# Altium schematic sheet [13] - CPU - UNUSED.SchDoc
size A2; DocumentNumber: 13; SheetNumber: 13; SheetTotal: 31
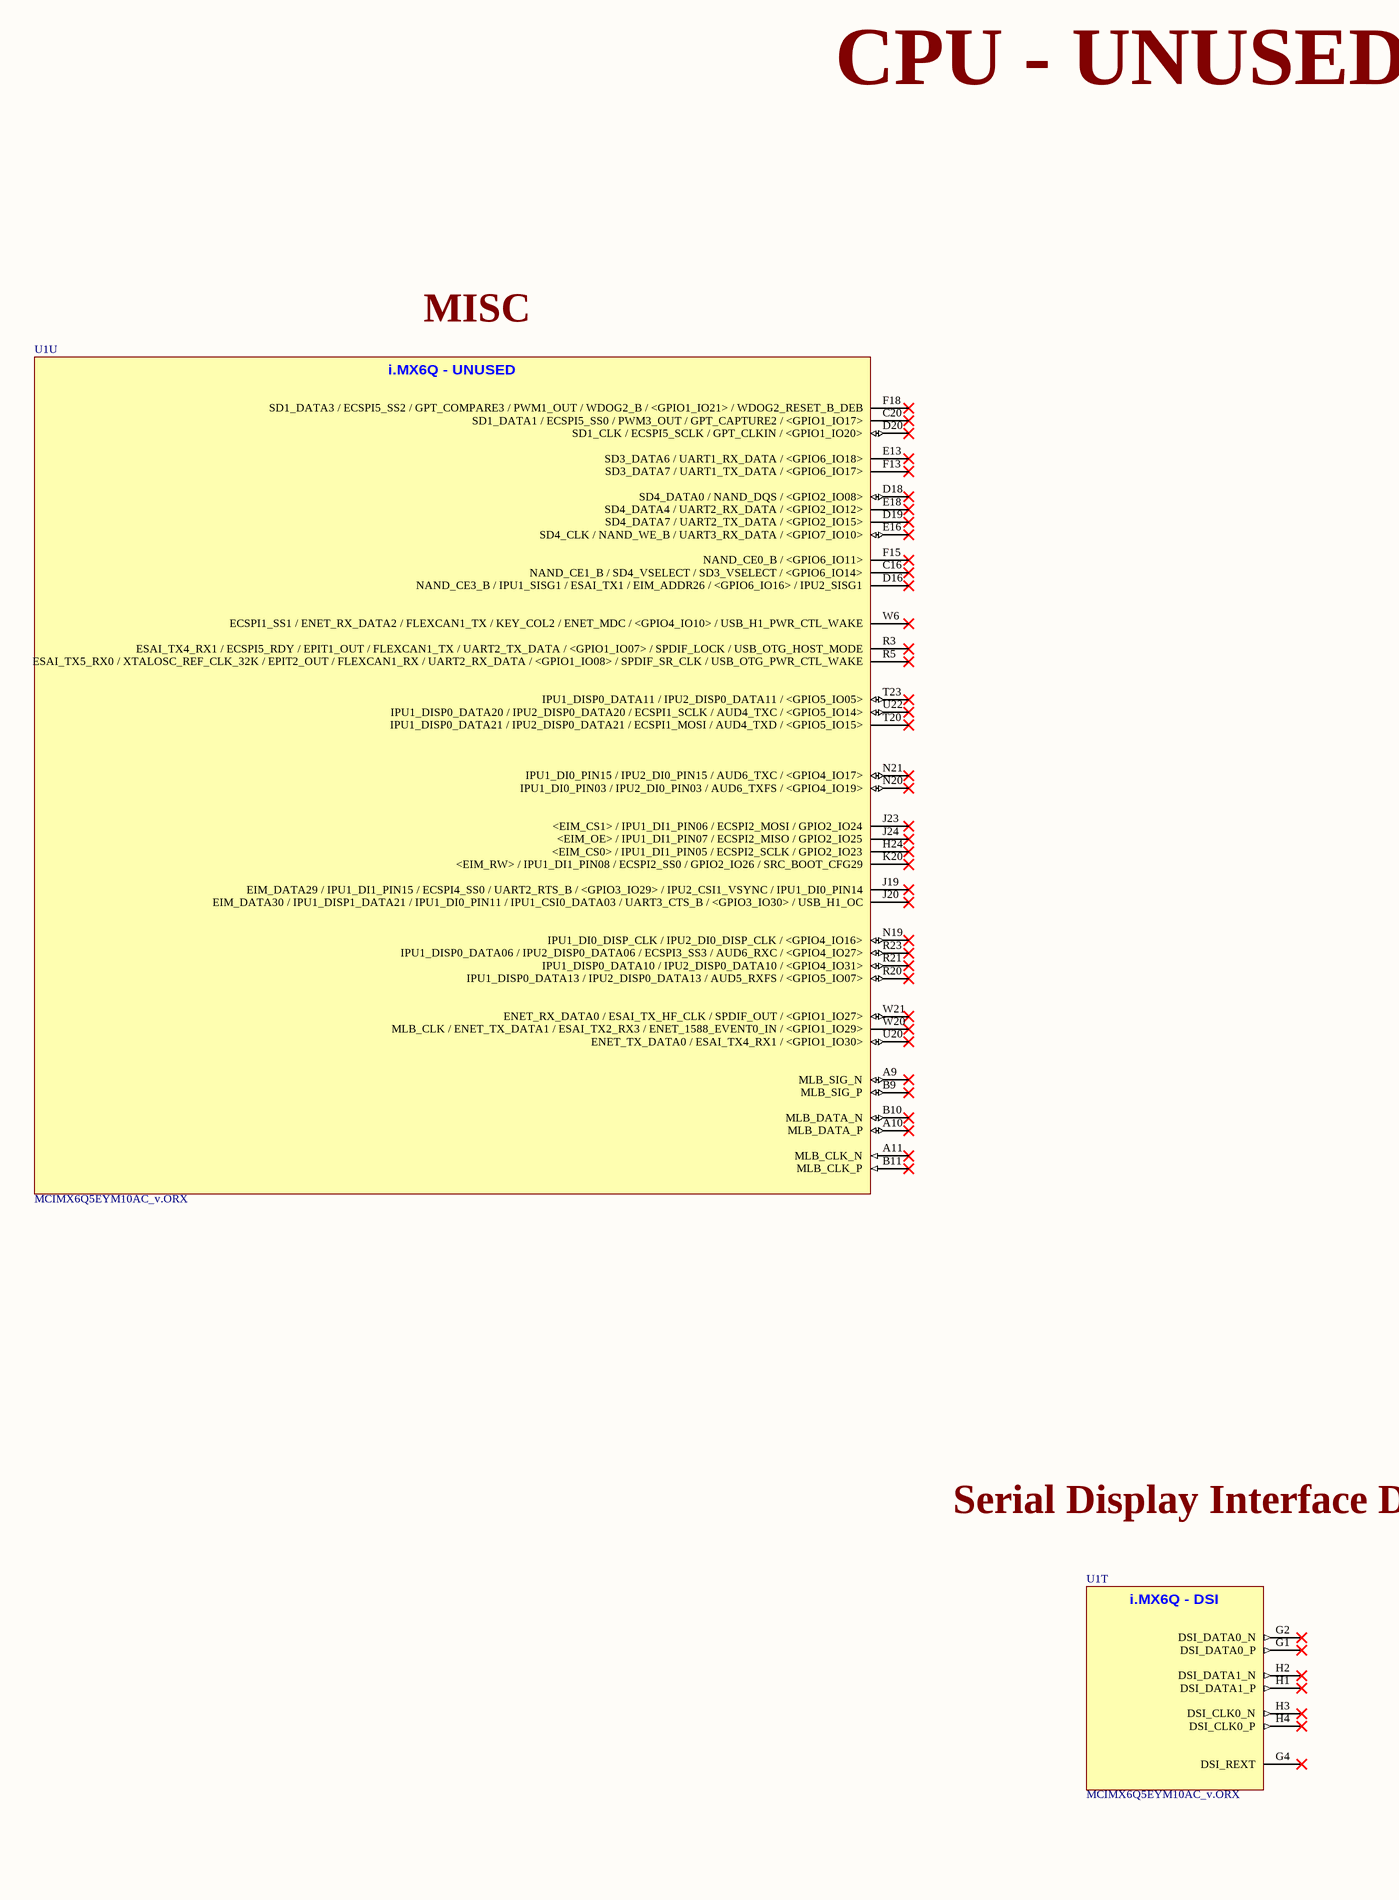
[diagram p0: [13] - CPU - UNUSED.SchDoc, left]
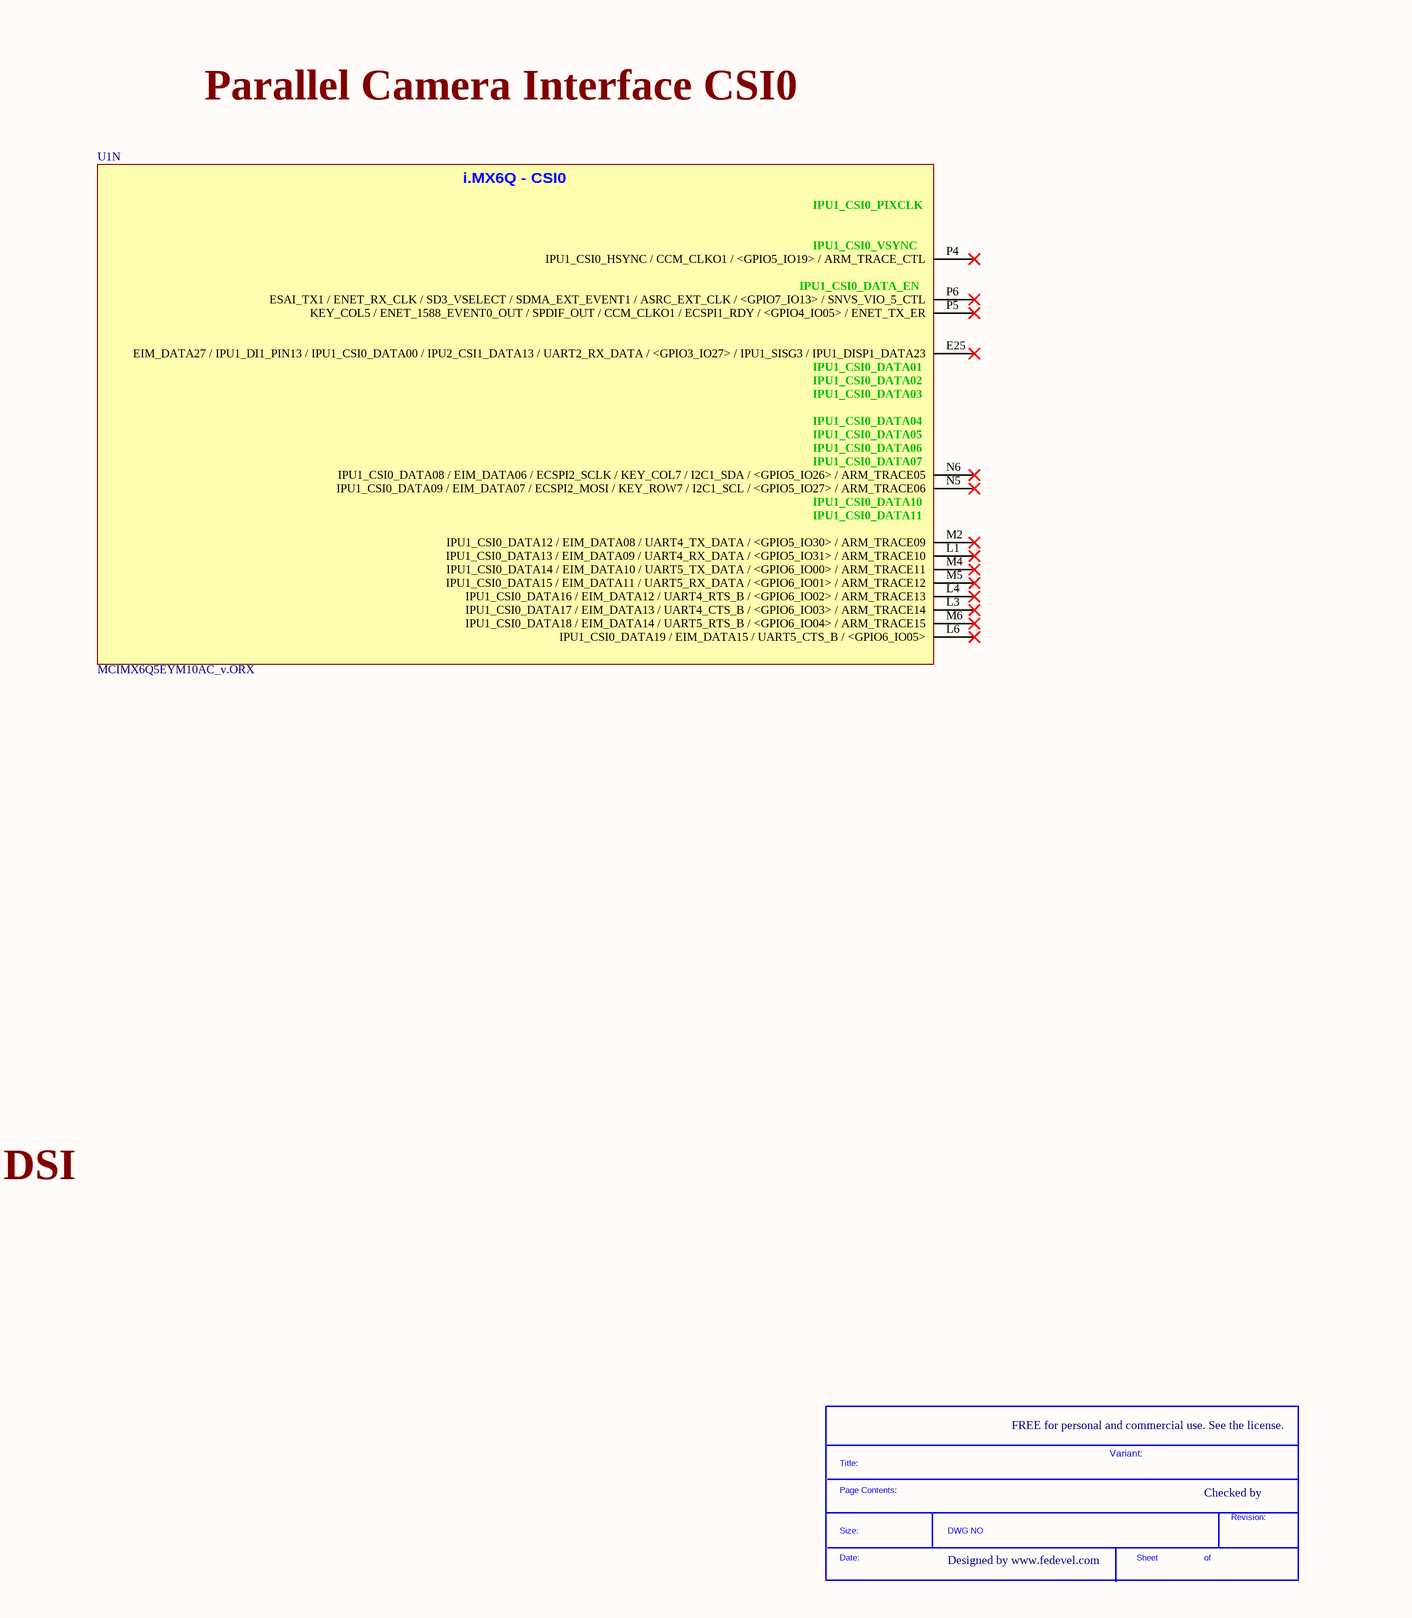
[diagram p1: [13] - CPU - UNUSED.SchDoc, right]

## Parts
*  SDTitleBlock  (value not drawn)  (graphical)
U1  MCIMX6Q5EYM10AC_v.ORX  [PBGA624]  (parts N,T,U of 21)

## Nets

Not connected (* = marked no-connect by the designer): U1 A9(MLB_SIG_N)* A10(MLB_DATA_P)* A11(MLB_CLK_N)* B9(MLB_SIG_P)* B10(MLB_DATA_N)* B11(MLB_CLK_P)* C16(NAND_CE1_B_/_SD4_VSELECT_/_SD3_VSELECT_/_<GPIO6_IO14>)* C20(SD1_DATA1_/_ECSPI5_SS0_/_PWM3_OUT_/_GPT_CAPTURE2_/_<GPIO1_IO17>)* D16(NAND_CE3_B_/_IPU1_SISG1_/_ESAI_TX1_/_EIM_ADDR26_/_<GPIO6_IO16>_/_IPU2_SISG1)* D18(SD4_DATA0_/_NAND_DQS_/_<GPIO2_IO08>)* D19(SD4_DATA7_/_UART2_TX_DATA_/_<GPIO2_IO15>)* D20(SD1_CLK_/_ECSPI5_SCLK_/_GPT_CLKIN_/_<GPIO1_IO20>)* E13(SD3_DATA6_/_UART1_RX_DATA_/_<GPIO6_IO18>)* E16(SD4_CLK_/_NAND_WE_B_/_UART3_RX_DATA_/_<GPIO7_IO10>)* E18(SD4_DATA4_/_UART2_RX_DATA_/_<GPIO2_IO12>)* E25(EIM_DATA27_/_IPU1_DI1_PIN13_/_IPU1_CSI0_DATA00_/_IPU2_CSI1_DATA13_/_UART2_RX_DATA_/_<GPIO3_IO27>_/_IPU1_SISG3_/_IPU1_DISP1_DATA23)* F13(SD3_DATA7_/_UART1_TX_DATA_/_<GPIO6_IO17>)* F15(NAND_CE0_B_/_<GPIO6_IO11>)* F18(SD1_DATA3_/_ECSPI5_SS2_/_GPT_COMPARE3_/_PWM1_OUT_/_WDOG2_B_/_<GPIO1_IO21>_/_WDOG2_RESET_B_DEB)* G1(DSI_DATA0_P)* G2(DSI_DATA0_N)* G4(DSI_REXT)* H1(DSI_DATA1_P)* H2(DSI_DATA1_N)* H3(DSI_CLK0_N)* H4(DSI_CLK0_P)* H24(<EIM_CS0>_/_IPU1_DI1_PIN05_/_ECSPI2_SCLK_/_GPIO2_IO23)* J19(EIM_DATA29_/_IPU1_DI1_PIN15_/_ECSPI4_SS0_/_UART2_RTS_B_/_<GPIO3_IO29>_/_IPU2_CSI1_VSYNC_/_IPU1_DI0_PIN14)* J20(EIM_DATA30_/_IPU1_DISP1_DATA21_/_IPU1_DI0_PIN11_/_IPU1_CSI0_DATA03_/_UART3_CTS_B_/_<GPIO3_IO30>_/_USB_H1_OC)* J23(<EIM_CS1>_/_IPU1_DI1_PIN06_/_ECSPI2_MOSI_/_GPIO2_IO24)* J24(<EIM_OE>_/_IPU1_DI1_PIN07_/_ECSPI2_MISO_/_GPIO2_IO25)* K20(<EIM_RW>_/_IPU1_DI1_PIN08_/_ECSPI2_SS0_/_GPIO2_IO26_/_SRC_BOOT_CFG29)* L1(IPU1_CSI0_DATA13_/_EIM_DATA09_/_UART4_RX_DATA_/_<GPIO5_IO31>_/_ARM_TRACE10)* L3(IPU1_CSI0_DATA17_/_EIM_DATA13_/_UART4_CTS_B_/_<GPIO6_IO03>_/_ARM_TRACE14)* L4(IPU1_CSI0_DATA16_/_EIM_DATA12_/_UART4_RTS_B_/_<GPIO6_IO02>_/_ARM_TRACE13)* L6(IPU1_CSI0_DATA19_/_EIM_DATA15_/_UART5_CTS_B_/_<GPIO6_IO05>)* M2(IPU1_CSI0_DATA12_/_EIM_DATA08_/_UART4_TX_DATA_/_<GPIO5_IO30>_/_ARM_TRACE09)* M4(IPU1_CSI0_DATA14_/_EIM_DATA10_/_UART5_TX_DATA_/_<GPIO6_IO00>_/_ARM_TRACE11)* M5(IPU1_CSI0_DATA15_/_EIM_DATA11_/_UART5_RX_DATA_/_<GPIO6_IO01>_/_ARM_TRACE12)* M6(IPU1_CSI0_DATA18_/_EIM_DATA14_/_UART5_RTS_B_/_<GPIO6_IO04>_/_ARM_TRACE15)* N5(IPU1_CSI0_DATA09_/_EIM_DATA07_/_ECSPI2_MOSI_/_KEY_ROW7_/_I2C1_SCL_/_<GPIO5_IO27>_/_ARM_TRACE06)* N6(IPU1_CSI0_DATA08_/_EIM_DATA06_/_ECSPI2_SCLK_/_KEY_COL7_/_I2C1_SDA_/_<GPIO5_IO26>_/_ARM_TRACE05)* N19(IPU1_DI0_DISP_CLK_/_IPU2_DI0_DISP_CLK_/_<GPIO4_IO16>)* N20(IPU1_DI0_PIN03_/_IPU2_DI0_PIN03_/_AUD6_TXFS_/_<GPIO4_IO19>)* N21(IPU1_DI0_PIN15_/_IPU2_DI0_PIN15_/_AUD6_TXC_/_<GPIO4_IO17>)* P4(IPU1_CSI0_HSYNC_/_CCM_CLKO1_/_<GPIO5_IO19>_/_ARM_TRACE_CTL)* P5(KEY_COL5_/_ENET_1588_EVENT0_OUT_/_SPDIF_OUT_/_CCM_CLKO1_/_ECSPI1_RDY_/_<GPIO4_IO05>_/_ENET_TX_ER)* P6(ESAI_TX1_/_ENET_RX_CLK_/_SD3_VSELECT_/_SDMA_EXT_EVENT1_/_ASRC_EXT_CLK_/_<GPIO7_IO13>_/_SNVS_VIO_5_CTL)* R3(ESAI_TX4_RX1_/_ECSPI5_RDY_/_EPIT1_OUT_/_FLEXCAN1_TX_/_UART2_TX_DATA_/_<GPIO1_IO07>_/_SPDIF_LOCK_/_USB_OTG_HOST_MODE)* R5(ESAI_TX5_RX0_/_XTALOSC_REF_CLK_32K_/_EPIT2_OUT_/_FLEXCAN1_RX_/_UART2_RX_DATA_/_<GPIO1_IO08>_/_SPDIF_SR_CLK_/_USB_OTG_PWR_CTL_WAKE)* R20(IPU1_DISP0_DATA13_/_IPU2_DISP0_DATA13_/_AUD5_RXFS_/_<GPIO5_IO07>)* R21(IPU1_DISP0_DATA10_/_IPU2_DISP0_DATA10_/_<GPIO4_IO31>)* R23(IPU1_DISP0_DATA06_/_IPU2_DISP0_DATA06_/_ECSPI3_SS3_/_AUD6_RXC_/_<GPIO4_IO27>)* T20(IPU1_DISP0_DATA21_/_IPU2_DISP0_DATA21_/_ECSPI1_MOSI_/_AUD4_TXD_/_<GPIO5_IO15>)* T23(IPU1_DISP0_DATA11_/_IPU2_DISP0_DATA11_/_<GPIO5_IO05>)* U20(ENET_TX_DATA0_/_ESAI_TX4_RX1_/_<GPIO1_IO30>)* U22(IPU1_DISP0_DATA20_/_IPU2_DISP0_DATA20_/_ECSPI1_SCLK_/_AUD4_TXC_/_<GPIO5_IO14>)* W6(ECSPI1_SS1_/_ENET_RX_DATA2_/_FLEXCAN1_TX_/_KEY_COL2_/_ENET_MDC_/_<GPIO4_IO10>_/_USB_H1_PWR_CTL_WAKE)* W20(MLB_CLK_/_ENET_TX_DATA1_/_ESAI_TX2_RX3_/_ENET_1588_EVENT0_IN_/_<GPIO1_IO29>)* W21(ENET_RX_DATA0_/_ESAI_TX_HF_CLK_/_SPDIF_OUT_/_<GPIO1_IO27>)*

## Notes on the sheet
- CPU - UNUSED PINS
- MISC
- Parallel Camera Interface CSI0
- Serial Display Interface DSI
- FREE for personal and commercial use. See the license.
- Variant:
- Checked by
- Designed by www.fedevel.com
- (in symbol MCIMX6Q5EYM10AC_v.ORX, part N) i.MX6Q - CSI0; IPU1_CSI0_PIXCLK; IPU1_CSI0_VSYNC; IPU1_CSI0_DATA_EN; IPU1_CSI0_DATA01; IPU1_CSI0_DATA02; IPU1_CSI0_DATA03; IPU1_CSI0_DATA04; IPU1_CSI0_DATA05; IPU1_CSI0_DATA06; IPU1_CSI0_DATA07; IPU1_CSI0_DATA10; IPU1_CSI0_DATA11
- (in symbol MCIMX6Q5EYM10AC_v.ORX, part T) i.MX6Q - DSI
- (in symbol MCIMX6Q5EYM10AC_v.ORX, part U) i.MX6Q - UNUSED
- (in symbol SDTitleBlock) Title:; Page Contents:; Revision:; Size:; DWG NO; Date:; Sheet; of

## Library data of the parts
U1 = MCIMX6Q5EYM10AC_v.ORX: IC MCU 32BIT ARM QUAD 624FCBGA; Manufacturer: Freescale Semiconductor; Core Processor: ARM® Cortex™-A9; Core Size: 32-Bit Quad-Core; Speed: 1.0GHz; Connectivity: CAN, EBI/EMI, ESAI, Ethernet, GPMI, I2C, MMC/SD, PCI, SATA, SPI, UART, USB, USB OTG; Peripherals: DMA, HDMI, I2S/SSI/AC97, MIPI CSI, MIMI DSI, MIPI HIS, PWM, WDT; Number of I /O: 224; Program Memory Type: External Program Memory; RAM Size: 256K x 8; Voltage - Supply (Vcc/Vdd): 0.925 V ~ 1.5 V; Oscillator Type: Internal; .Creator: MM; .Checked PCB: MM, checked by RF; Supplier 1: Digi-Key; Manufacturer Part Number: MCIMX6Q5EYM10AC; RoHS: RoHS Compliant; Category: Integrated Circuits (ICs); Stock 1: 0; Pricing 1: 1=54.98, 10=51.922, 25=48.868, 100=30.5424 (USD); Program Memory Size: -; EEPROM Size: -; Data Converters: -; Operating Temperature: -20°C ~ 105°C; Package / Case: 624-FBGA, FCBGA; Packaging: Tray; ComponentLink1URL: http://cache.freescale.com/files/32bit/doc/data_sheet/IMX6DQCEC.pdf; ComponentLink1Description: http://cache.freescale.com/files/32bit/doc/data_sheet/IMX6DQCEC.pdf; Supplier Part Number 1: MCIMX6Q5EYM10AC-ND